# EAGLE schematic Center panel V1.3 (EAGLE 8.3.1)
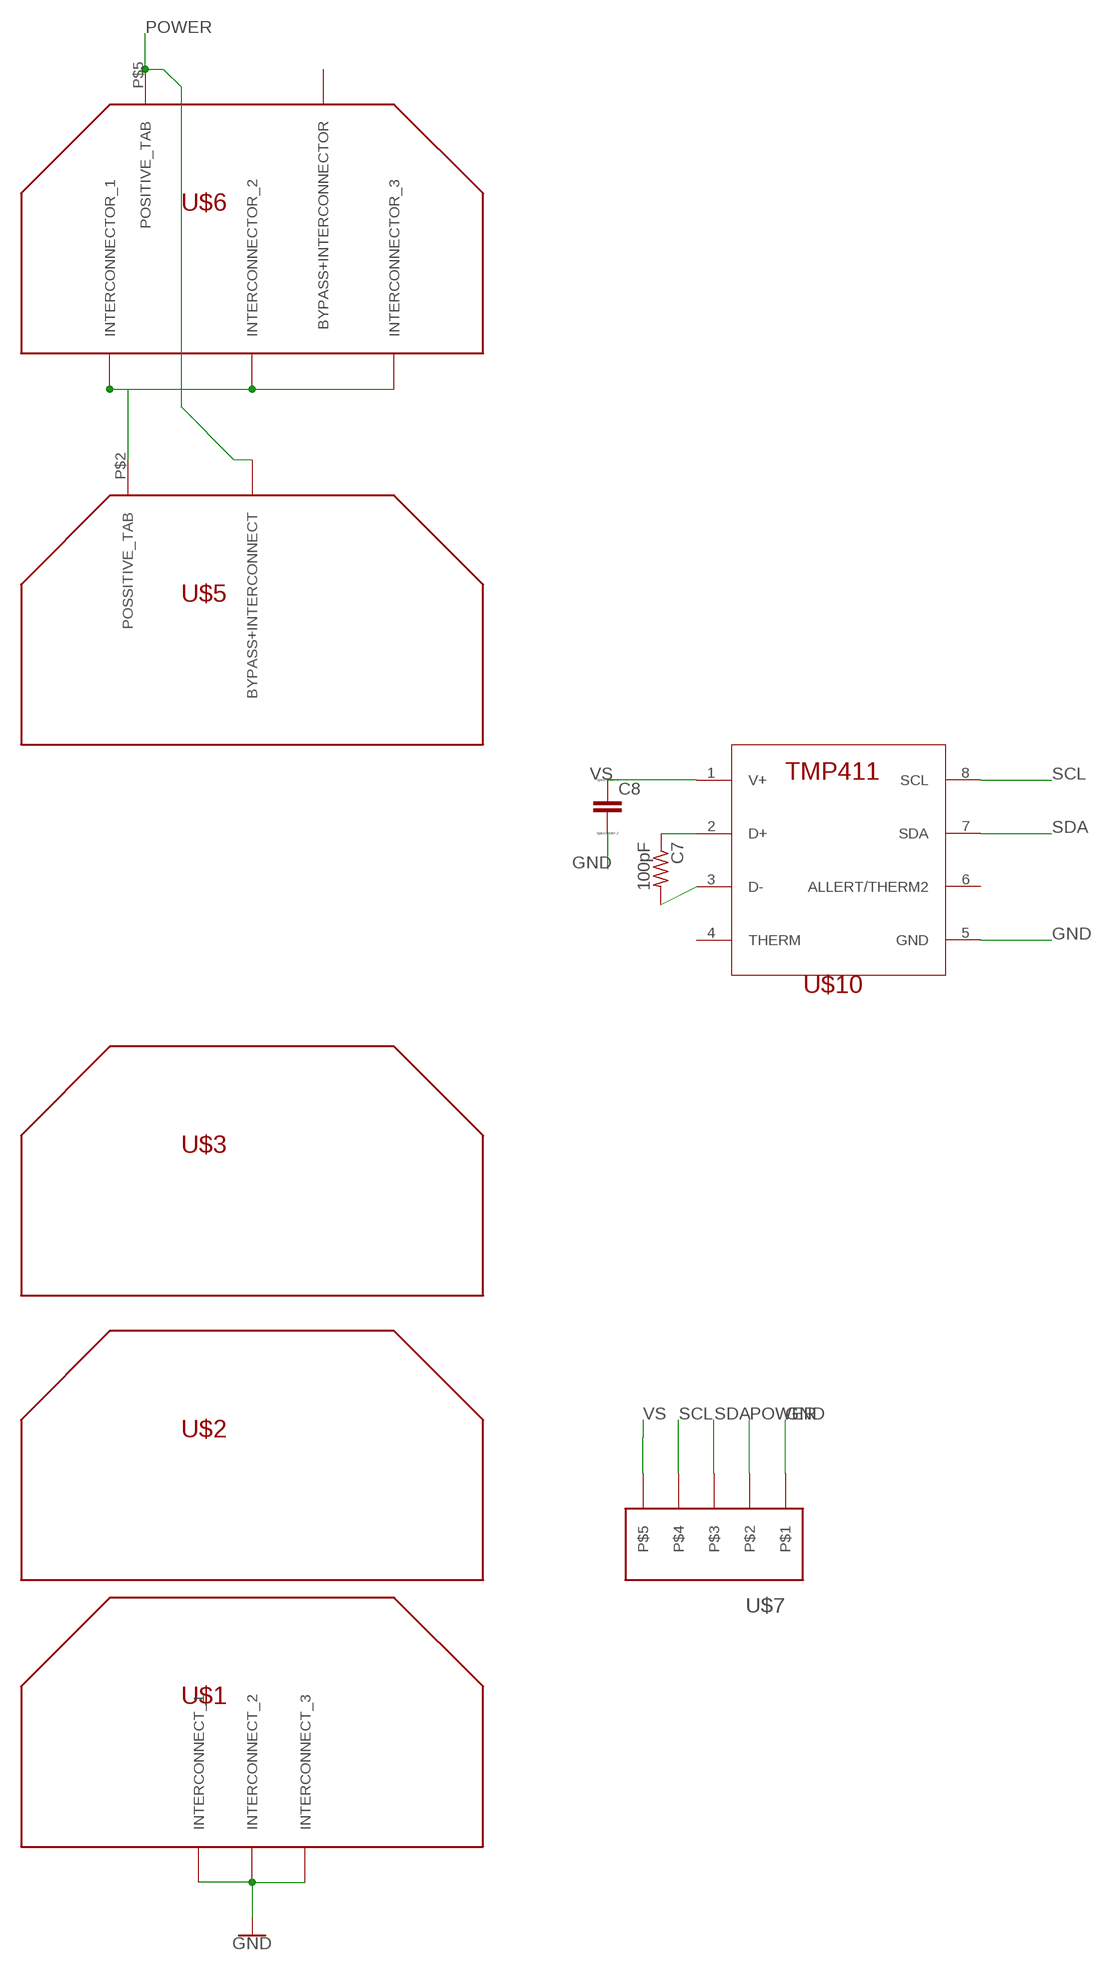
[diagram p0: schematic, sheet 1]

## Parts
C7  100pF  R-US_R0805  [R0805]
C8  C  [C0805]
U$1  SOLAR_CELL_BOTTOM  [SOLAR_CELL_BOTTOM_SHORT-PADS]
U$2  SOALAR_CELL_OUTLINE  [SOLAR_CELL_OUTLINE]
U$3  SOALAR_CELL_OUTLINE  [SOLAR_CELL_OUTLINE]
U$5  SOLAR_CELL_TOP  [SOLAR_CELL_TOP_SHORT-PAD]
U$6  SOLAR_CELL_STAND-ALONE  [SOLAR_CELL_STAND-ALONE]
U$7  PICOLOCK_5  [PICOLOCK_5]
U$10  TMP411  [TSSOP-8]

## Nets
GND: C8.2 U$1.P$1(INTERCONNECT_1) U$1.P$2(INTERCONNECT_2) U$1.P$3(INTERCONNECT_3) U$7.P$1 U$10.5(GND)
N$7: U$5.P$2(POSSITIVE_TAB) U$6.P$1(INTERCONNECTOR_1) U$6.P$2(INTERCONNECTOR_2) U$6.P$3(INTERCONNECTOR_3)
N$14: C7.1 U$10.2(D+)
N$15: C7.2 U$10.3(D-)
POWER: U$5.P$1(BYPASS+INTERCONNECT) U$6.P$5(POSITIVE_TAB) U$7.P$2
SCL: U$7.P$4 U$10.8(SCL)
SDA: U$7.P$3 U$10.7(SDA)
VS: C8.1 U$7.P$5 U$10.1(V+)
Unconnected: U$6.P$4(BYPASS+INTERCONNECTOR) U$10.4(THERM) U$10.6(ALLERT/THERM2)

## Library data of the parts
C7 = Battery board V4.1 - simple signals:R-US_: RESISTOR, American symbol
C8 = Battery board V4.1 - simple signals:C: CAPACITOR, European symbol; SPICEMODEL: NONE; SPICEPREFIX: C
U$1 = DubSat1 Components:SOLAR_CELL_BOTTOM: Azurspace Solar cell: http://www.azurspace.com/images/products/0003401-01-01_DB_3G30A.pdf Contains an outline of the cell with pads on the bottom for the main interconnectors. To be used as the bottom cell in a string of cells.
U$2 U$3 = DubSat1 Components:SOALAR_CELL_OUTLINE: Azurspace Solar Cell: http://www.azurspace.com/images/products/0003401-01-01_DB_3G30A.pdf Contains an outline of the solar cell without any pads because the interconnectors will be attached externaly and not on the board. This footprint is to be used as the center cells in a string of cells.
U$5 = DubSat1 Components:SOLAR_CELL_TOP: Azurspace solar cell: http://www.azurspace.com/images/products/0003401-01-01_DB_3G30A.pdf With outline of full cell + pad for top side introconnector and integrated bypass diode. To be used as the top cell in a string of cells.
U$6 = DubSat1 Components:SOLAR_CELL_STAND-ALONE
U$7 = DubSat1 Components:PICOLOCK_5
U$10 = DubSat1 Components:TMP411